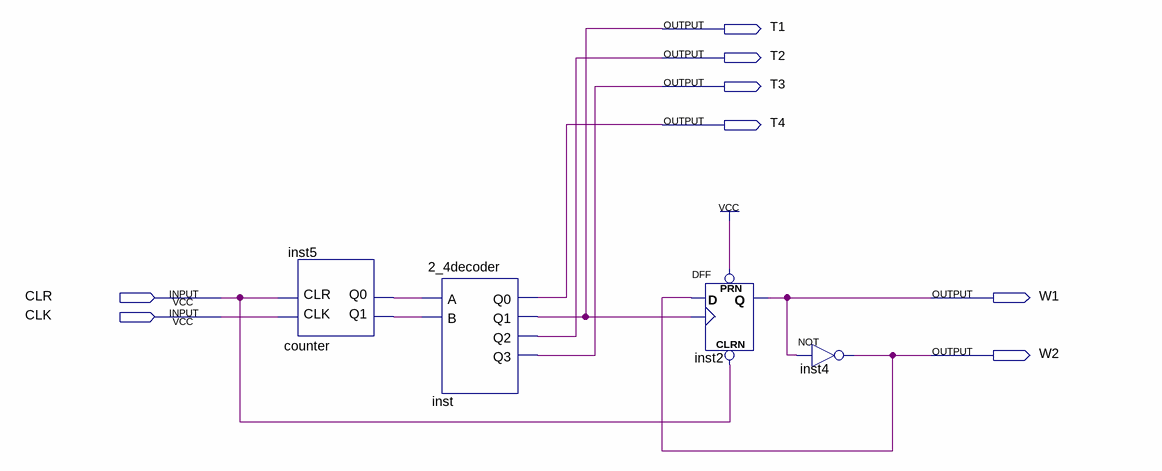
[diagram p0: schematic sheet]
// Quartus schematic JP.bdf as structural Verilog: 4 symbols, 8 pins
module JP (
  input  CLR,
  input  CLK,
  output T1,
  output T2,
  output T3,
  output T4,
  output W1,
  output W2
);

  wire inst5_q0, inst5_q1;

  counter inst5 (.CLK(CLK), .CLR(CLR), .Q1(inst5_q1), .Q0(inst5_q0));
  \2_4decoder  inst (.A(inst5_q0), .B(inst5_q1), .Q0(T4), .Q1(T1), .Q2(T2), .Q3(T3));
  DFF inst2 (.CLRN(CLR), .CLK(T1), .D(W2), .PRN(1'b1), .Q(W1));
  not inst4 (W2, W1);
endmodule
